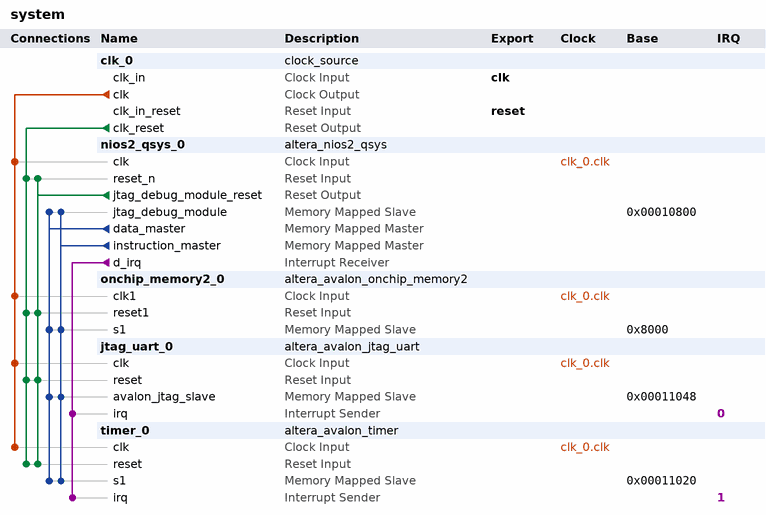
[diagram p0: system contents]
# Platform Designer (Qsys) system system, Cyclone IV E EP4CE115F29C8
# Parameters at their usual value, and those the tool derives, are not listed.
package require -exact qsys 13.0.1.99.2
create_system system
set_project_property DEVICE_FAMILY {Cyclone IV E}
set_project_property DEVICE EP4CE115F29C8

add_instance clk_0 clock_source 13.0
set_instance_parameter_value clk_0 clockFrequency 50000000

add_instance nios2_qsys_0 altera_nios2_qsys 13.0
set_instance_parameter_value nios2_qsys_0 resetSlave onchip_memory2_0.s1
set_instance_parameter_value nios2_qsys_0 mmu_TLBMissExcSlave None
set_instance_parameter_value nios2_qsys_0 exceptionSlave onchip_memory2_0.s1
set_instance_parameter_value nios2_qsys_0 breakSlave nios2_qsys_0.jtag_debug_module
set_instance_parameter_value nios2_qsys_0 impl Tiny
set_instance_parameter_value nios2_qsys_0 icache_size 4096

add_instance onchip_memory2_0 altera_avalon_onchip_memory2 13.0.1.99.2
set_instance_parameter_value onchip_memory2_0 dataWidth 32
set_instance_parameter_value onchip_memory2_0 dualPort false
set_instance_parameter_value onchip_memory2_0 initMemContent true
set_instance_parameter_value onchip_memory2_0 initializationFileName onchip_mem.hex
set_instance_parameter_value onchip_memory2_0 memorySize 32768

add_instance jtag_uart_0 altera_avalon_jtag_uart 13.0.1.99.2
set_instance_parameter_value jtag_uart_0 simInteractiveOptions NO_INTERACTIVE_WINDOWS

add_instance timer_0 altera_avalon_timer 13.0.1.99.2
set_instance_parameter_value timer_0 period 1
set_instance_parameter_value timer_0 periodUnits MSEC

# connections
add_connection clk_0.clk jtag_uart_0.clk clock
add_connection clk_0.clk nios2_qsys_0.clk clock
add_connection clk_0.clk onchip_memory2_0.clk1 clock
add_connection clk_0.clk timer_0.clk clock
add_connection clk_0.clk_reset jtag_uart_0.reset reset
add_connection clk_0.clk_reset nios2_qsys_0.reset_n reset
add_connection clk_0.clk_reset onchip_memory2_0.reset1 reset
add_connection clk_0.clk_reset timer_0.reset reset
add_connection nios2_qsys_0.jtag_debug_module_reset jtag_uart_0.reset reset
add_connection nios2_qsys_0.jtag_debug_module_reset nios2_qsys_0.reset_n reset
add_connection nios2_qsys_0.jtag_debug_module_reset onchip_memory2_0.reset1 reset
add_connection nios2_qsys_0.jtag_debug_module_reset timer_0.reset reset
add_connection nios2_qsys_0.data_master jtag_uart_0.avalon_jtag_slave avalon
set_connection_parameter_value nios2_qsys_0.data_master/jtag_uart_0.avalon_jtag_slave baseAddress 0x00011048
add_connection nios2_qsys_0.data_master nios2_qsys_0.jtag_debug_module avalon
set_connection_parameter_value nios2_qsys_0.data_master/nios2_qsys_0.jtag_debug_module baseAddress 0x00010800
add_connection nios2_qsys_0.data_master onchip_memory2_0.s1 avalon
set_connection_parameter_value nios2_qsys_0.data_master/onchip_memory2_0.s1 baseAddress 0x8000
add_connection nios2_qsys_0.data_master timer_0.s1 avalon
set_connection_parameter_value nios2_qsys_0.data_master/timer_0.s1 baseAddress 0x00011020
add_connection nios2_qsys_0.instruction_master jtag_uart_0.avalon_jtag_slave avalon
set_connection_parameter_value nios2_qsys_0.instruction_master/jtag_uart_0.avalon_jtag_slave baseAddress 0x00011048
add_connection nios2_qsys_0.instruction_master nios2_qsys_0.jtag_debug_module avalon
set_connection_parameter_value nios2_qsys_0.instruction_master/nios2_qsys_0.jtag_debug_module baseAddress 0x00010800
add_connection nios2_qsys_0.instruction_master onchip_memory2_0.s1 avalon
set_connection_parameter_value nios2_qsys_0.instruction_master/onchip_memory2_0.s1 baseAddress 0x8000
add_connection nios2_qsys_0.instruction_master timer_0.s1 avalon
set_connection_parameter_value nios2_qsys_0.instruction_master/timer_0.s1 baseAddress 0x00011020
add_connection nios2_qsys_0.d_irq jtag_uart_0.irq interrupt
set_connection_parameter_value nios2_qsys_0.d_irq/jtag_uart_0.irq irqNumber 0
add_connection nios2_qsys_0.d_irq timer_0.irq interrupt
set_connection_parameter_value nios2_qsys_0.d_irq/timer_0.irq irqNumber 1

# exported interfaces
add_interface clk clock sink
set_interface_property clk EXPORT_OF clk_0.clk_in
add_interface reset reset sink
set_interface_property reset EXPORT_OF clk_0.clk_in_reset

set_interconnect_requirement {$system} qsys_mm.clockCrossingAdapter HANDSHAKE
set_interconnect_requirement {$system} qsys_mm.maxAdditionalLatency 1

save_system system.qsys
